# EAGLE design ESP8266 12E 1.5 (EAGLE 9.6.2)
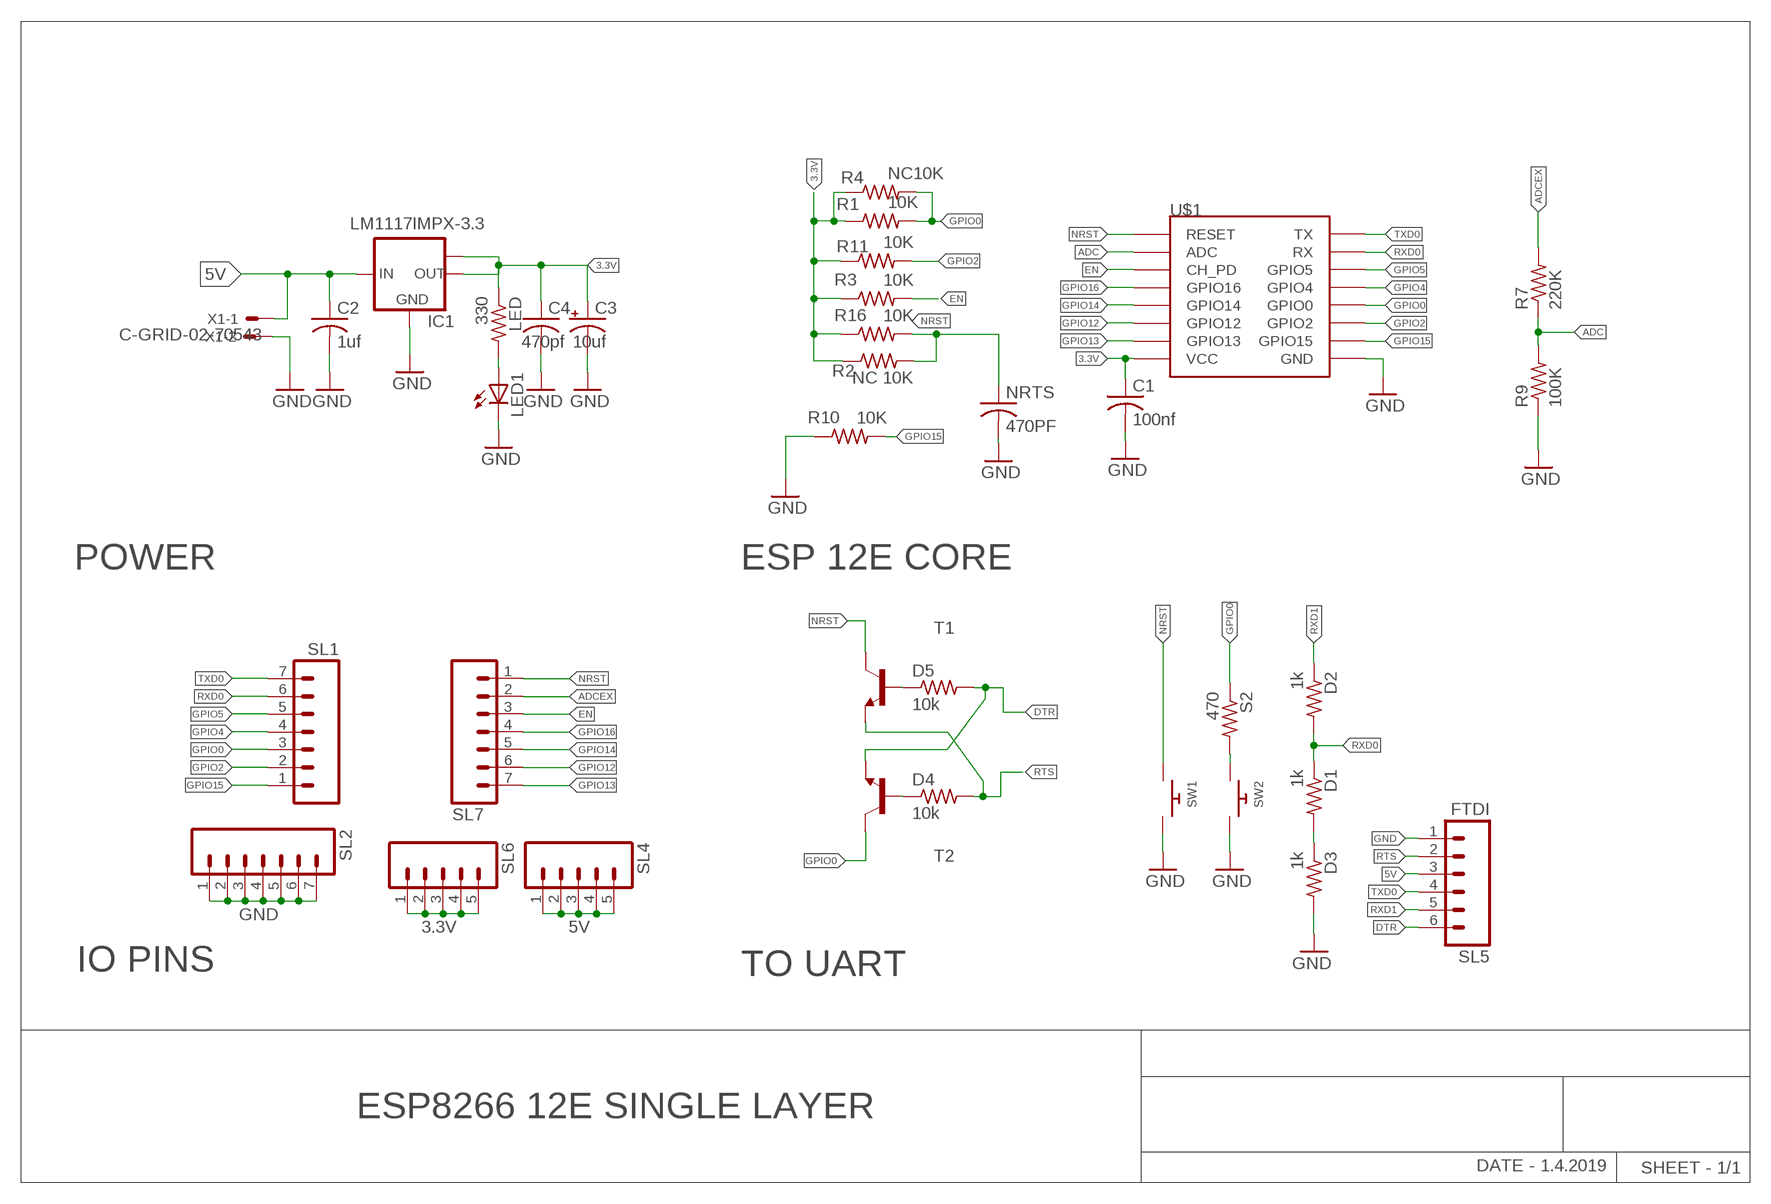
[diagram p0: schematic, sheet 1]

## Parts
C1  100nf  C-US050-025X075  [C050-025X075]
C2  1uf  C-US050-030X075  [C050-030X075]
C3  10uf  CPOL-USE2.5-5  [E2,5-5]
C4  470pf  C-US050-025X075  [C050-025X075]
D1  1k  R-US_0309/10  [0309/10]
D2  1k  R-US_0309/10  [0309/10]
D3  1k  R-US_0309/10  [0309/10]
D4  10k  R-US_0309/10  [0309/10]
D5  10k  R-US_0309/10  [0309/10]
IC1  LM1117IMPX-3.3  [SOT223]
LED  330  R-US_0309/10  [0309/10]
LED1  LED3MM  [LED3MM]
NRTS  470PF  C-US050-025X075  [C050-025X075]
R1  10K  R-US_0207/7  [0207/7]
R2  NC 10K  R-US_M1206  [M1206]
R3  10K  R-US_0207/7  [0207/7]
R4  NC10K  R-US_0207/7  [0207/7]
R7  220K  R-US_0309/10  [0309/10]
R9  100K  R-US_0309/10  [0309/10]
R10  10K  R-US_0207/7  [0207/7]
R11  10K  R-US_0207/7  [0207/7]
R16  10K  R-US_0207/7  [0207/7]
S2  470  R-US_0309/10  [0309/10]
SL1  M07  [07P]
SL2  M07  [07P]
SL4  M05  [05P]
SL5  FTDI  M06  [06P]
SL6  M05  [05P]
SL7  M07  [07P]
SW1  SWITCH_PUSHBUTTONEVQ  [0204/5]
SW2  SWITCH_PUSHBUTTONEVQ  [0204/5]
T1  2N2222  [TO92-EBC-OVAL]
T2  2N2222  [TO92-EBC-OVAL]
U$1  ESP8266  [ESP8266MIRROR]
X1  C-GRID-02-70543  [70543-02]

## Nets
3.3V: C1.1 C3.+ C4.1 IC1.2(OUT) IC1.TAB(OUT1) LED.1 R1.1 R2.1 R3.1 R4.1 R11.1 R16.1 SL6.1 SL6.2 SL6.3 SL6.4 SL6.5 U$1.VCC
5V: C2.1 IC1.3(IN) SL4.1 SL4.2 SL4.3 SL4.4 SL4.5 SL5.3 X1.1
ADC: R7.1 R9.2 U$1.ADC
ADCEX: R7.2 SL7.2
DTR: D5.2 SL5.6 T2.E
EN: R3.2 SL7.3 U$1.EN(CH_PD)
GND: C1.2 C2.2 C3.- C4.2 D3.2 IC1.1(GND) LED1.K(C) NRTS.2 R9.1 R10.1 SL2.1 SL2.2 SL2.3 SL2.4 SL2.5 SL2.6 SL2.7 SL5.1 SW1.2 SW2.2 U$1.GND X1.2
GPIO0: R1.2 R4.2 S2.1 SL1.3 T2.C U$1.0(GPIO0)
GPIO2: R11.2 SL1.2 U$1.2(GPIO2)
GPIO4: SL1.4 U$1.4(GPIO4)
GPIO5: SL1.5 U$1.5(GPIO5)
GPIO12: SL7.6 U$1.12(GPIO12)
GPIO13: SL7.7 U$1.13(GPIO13)
GPIO14: SL7.5 U$1.14(GPIO14)
GPIO15: R10.2 SL1.1 U$1.15(GPIO15)
GPIO16: SL7.4 U$1.16(GPIO16)
N$1: D5.1 T1.B
N$2: D4.1 T2.B
N$3: S2.2 SW2.1
N$4: LED1.A LED.2
N$5: D1.2 D3.1
NRST: NRTS.1 R2.2 R16.2 SL7.1 SW1.1 T1.C U$1.RST(RESET)
RTS: D4.2 SL5.2 T1.E
RXD0: D1.1 D2.2 SL1.6 U$1.RX
RXD1: D2.1 SL5.5
TXD0: SL1.7 SL5.4 U$1.TX

## Notes on the sheet
- POWER | ESP 12E CORE
- IO PINS | TO UART
- ESP8266 12E SINGLE LAYER
- DATE - 1.4.2019 | SHEET - 1/1

## Library data of the parts
C1 C4 NRTS = resistor:C-US: CAPACITOR, American symbol
C2 = adafruit:C-US: CAPACITOR, American symbol
C3 = adafruit:CPOL-US: POLARIZED CAPACITOR, American symbol
D1-D5 LED R1-R4 R7 R9-R11 R16 S2 = adafruit:R-US_: RESISTOR, American symbol
IC1 = lm1117:LM1117IMPX-*
LED1 = adafruit:LED: LED OSRAM: - CHIPLED LG R971, LG N971, LY N971, LG Q971, LY Q971, LO R971, LY R971 LH N974, LH R974 LS Q976, LO Q976, LY Q976 LO Q996 - Hyper CHIPLED LW Q18S LB Q993, LB Q99A, LB R99A - SideLED LS A670, LO A670, LY A670, LG A670, LP A670 LB A673, LV A673, LT A673, LW A673 LH A674 LY A675 LS A676, LA A676, LO A676, LY A676, LW A676 LS A679, LY A679, LG A679 - Hyper Micro SIDELED® LS Y876, LA Y876, LO Y876, LY Y876 LT Y87S - SmartLED LW L88C, LW L88S LB L89C, LB L89S, LG L890 LS L89K, LO L89K, LY L89K LS L896, LA L896, LO L896, LY L896 - TOPLED LS T670, LO T670, LY T670, LG T670, LP T670 LSG T670, LSP T670, LSY T670, LOP T670, LYG T670 LG T671, LOG T671, LSG T671 LB T673, LV T673, LT T673, LW T673 LH T674 LS T676, LA T676, LO T676, LY T676, LB T676, LH T676, LSB T676, LW T676 LB T67C, LV T67C, LT T67C, LS T67K, LO T67K, LY T67K, LW E67C LS E67B, LA E67B, LO E67B, LY E67B, LB E67C, LV E67C, LT E67C LW T67C LS T679, LY T679, LG T679 LS T770, LO T770, LY T770, LG T770, LP T770 LB T773, LV T773, LT T773, LW T773 LH T774 LS E675, LA E675, LY E675, LS T675 LS T776, LA T776, LO T776, LY T776, LB T776 LHGB T686 LT T68C, LB T68C - Hyper Mini TOPLED® LB M676 - Mini TOPLED Santana® LG M470 LS M47K, LO M47K, LY M47K Source: http://www.osram.convergy.de/
SL1 SL2 SL7 = con-amp-quick:M07: AMP QUICK CONNECTOR; OC_FARNELL: unknown; OC_NEWARK: unknown
SL4 SL6 = con-amp-quick:M05: AMP QUICK CONNECTOR; OC_FARNELL: unknown; OC_NEWARK: unknown
SL5 = con-amp-quick:M06: AMP QUICK CONNECTOR; OC_FARNELL: unknown; OC_NEWARK: unknown
SW1 SW2 = mylib:SWITCH_PUSHBUTTON: Buttons SOFTTOUCHSMD_SJ - Soft touch temporary push button (Super Junk Akihabara) Compatible with SKPMANE010 [Mouser: 688-SKPMAN] C&K_KSS = Digikey: KSS221GLFS
T1 T2 = adafruit:2N2222: NPN TRANSISTOR Big oval pads
U$1 = ESPCUSTOM:ESP8266
X1 = con-molex:C-GRID-02: CONNECTOR wire to board 2.54 mm (0.100") pitch header; MF: MOLEX; OC_FARNELL: unknown; OC_NEWARK: unknown

## Net classes
0 default: clearance 0.406 mm
1 VCC: width 0.762 mm, clearance 0.406 mm
2 GND: width 0.914 mm, clearance 0.406 mm

## Board
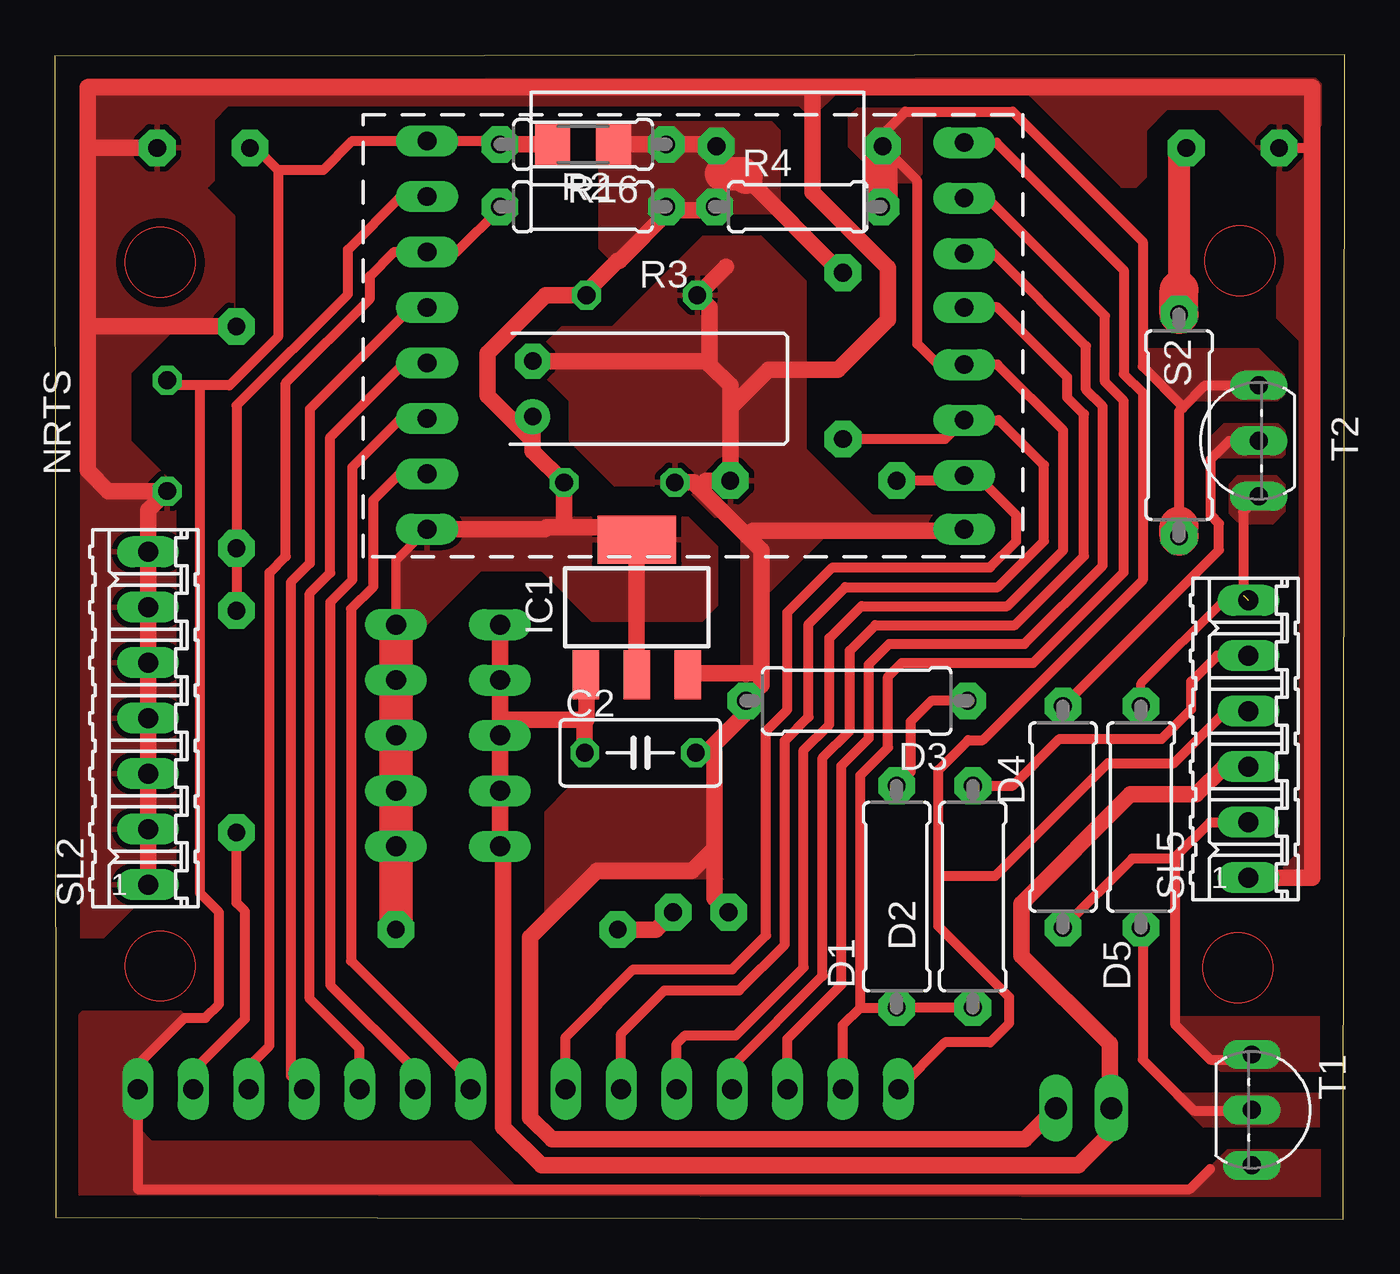
[diagram p1: board, top side]
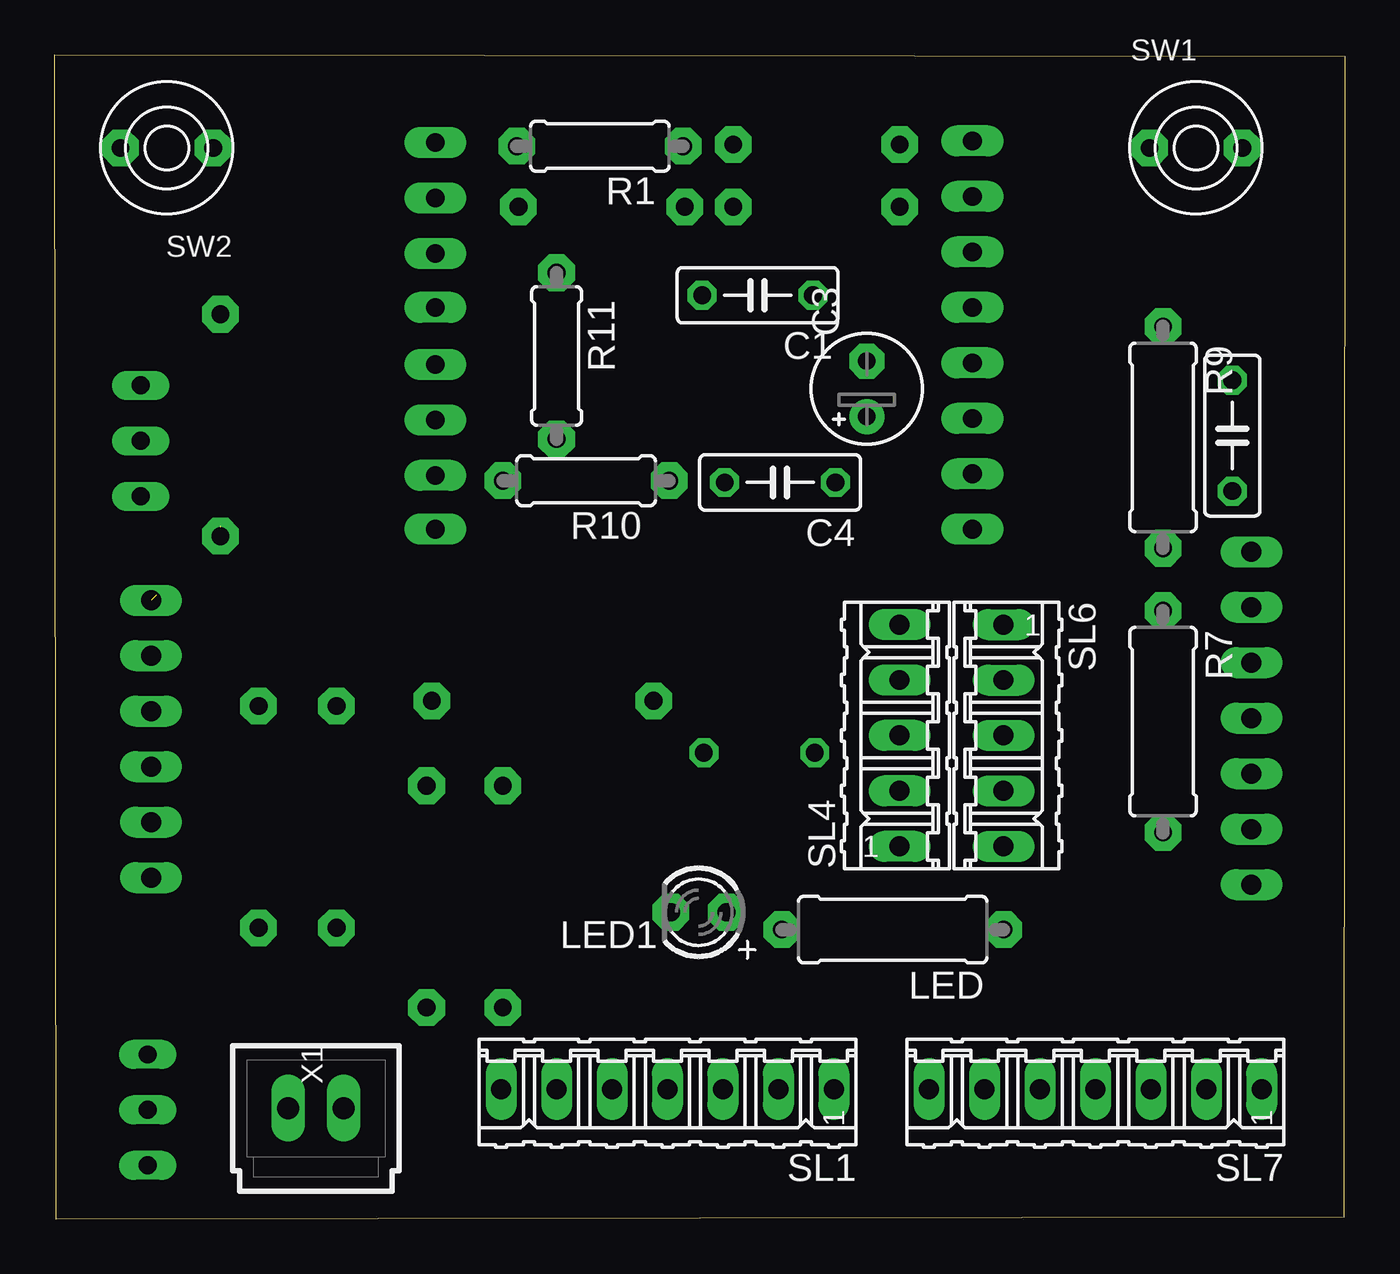
[diagram p2: board, bottom side, seen from below]

Size 59.11 x 53.33 mm. Coordinates in mm from the lower left corner, seen from the top.
Outline: 0.05,0.08 59.04,0 59.11,53.33 0,53.25 0.05,0.08
Copper layers (1*16): Top 0.035mm / dielectric 1.5mm / Bottom 0.035mm
Design rules "default": minimum track width 6mil, minimum drill 0.35mm, track to track 6mil, track to pad 6mil, pad to pad 6mil, via to via 6mil, smd to smd 6mil, copper to edge 40mil, drill to drill 6mil, minimum pad ring 10mil, minimum via ring 8mil, stop-mask expansion 4mil, vias tented up to drill 0mil, thermal gap 10mil

### Footprints (pad centres in the part's own frame; a part is rotated, then mirrored left to right if it is on the bottom)
C050-025X075 = drill 0.813 octagon: 1 -2.54,0; 2 2.54,0
C050-030X075 = drill 0.813 octagon: 1 -2.54,0; 2 2.54,0
E2,5-5 = drill 0.813 pad 1.6: + -1.27,0 | drill 0.813 pad 1.6 octagon: - 1.27,0
0309/10 = drill 0.813 pad 1.676 octagon: 1 -5.08,0; 2 5.08,0
SOT223 = smd 1.219 x 2.235: 1 2.332,-3.099; 2 0,-3.099; 3 -2.332,-3.099 | smd 3.6 x 2.2: TAB 0,3.099
LED3MM = drill 0.813 pad 1.676 octagon: A -1.27,0; K 1.27,0
0207/7 = drill 0.813 pad 1.676 octagon: 1 -3.81,0; 2 3.81,0
M1206 = smd 1.6 x 2: 1 -1.4,0; 2 1.4,0
07P = drill 0.914 long: 1 -7.62,0; 2 -5.08,0; 3 -2.54,0; 4 0,0; 5 2.54,0; 6 5.08,0; 7 7.62,0
05P = drill 0.914 long: 1 -5.08,0; 2 -2.54,0; 3 0,0; 4 2.54,0; 5 5.08,0
06P = drill 0.914 long: 1 -6.35,0; 2 -3.81,0; 3 -1.27,0; 4 1.27,0; 5 3.81,0; 6 6.35,0
0204/5 = drill 0.813 pad 1.676 octagon: 1 -2.125,0; 2 2.125,0
TO92-EBC-OVAL = drill 0.813 long: B 0,-1.27; C 2.54,-1.27; E -2.54,-1.27
ESP8266MIRROR = drill 0.85 pad 1.422 long: 0 12.224,-4.842; 2 12.224,-7.382; 4 12.224,-2.223; 5 12.224,0.238; 12 -12.383,-7.303; 13 -12.383,-9.842; 14 -12.383,-4.763; 15 12.224,-9.922; 16 -12.383,-2.223; ADC -12.383,2.857; EN -12.383,0.318; GND 12.224,-12.383; RST -12.383,5.397; RX 12.224,2.778; TX 12.224,5.318; VCC -12.383,-12.383
70543-02 = drill 1.016 long: 1 -1.27,0; 2 1.27,0

### Placement (x,y rotation side)
C1  26.91,42.31 180 bottom
C2  26.83,21.35 0 top
C3  21.91,38.02 90 bottom
C4  25.88,33.73 180 bottom
D1  38.58,14.76 90 top
D2  42.07,14.76 270 top
D3  36.75,23.73 180 top
D4  46.2,18.41 270 top
D5  49.77,18.41 90 top
IC1  26.67,28.02 0 top
LED  20.72,13.26 180 bottom
LED1  29.61,14.05 180 bottom
NRTS  5.16,35.88 270 bottom
R1  34.13,49.13 180 bottom
R2  24.21,49.21 180 top
R3  24.21,46.36 180 top
R4  34.05,46.36 0 top
R7  8.33,22.78 270 bottom
R9  8.33,35.8 270 bottom
R10  34.77,33.81 180 bottom
R11  36.12,39.53 270 bottom
R16  24.21,49.21 180 top
S2  51.51,36.35 90 top
SL1  31.04,5.95 180 bottom
SL2  4.29,22.94 90 top
SL4  20.4,22.15 90 bottom
SL5  54.69,21.99 90 top
SL6  15.64,22.15 270 bottom
SL7  11.43,5.95 180 bottom
SW1  6.83,49.05 0 bottom
SW2  53.98,49.05 180 bottom
T1  56.12,5 270 top
T2  53.9,35.64 90 top
U$1  29.45,43.97 0 top
X1  47.15,5.08 0 bottom

### Tracks (layer width: path | path; a pad name or v marks a point on that pad's centre or on a via)
3.3V
  Top 0.406: SL6.1 15.64,30.16 U$1.VCC
  Top 0.457: R3.1 28.02,46.91
  Top 0.762: 28.18,46.2 25.88,43.89 25.8,43.89 24.37,42.47 C1.1 22.5,42.31 19.84,39.65 19.84,37.7 21.91,35.64 | R3.1 28.18,46.2 | 28.18,46.2 30.56,46.2 30.56,47.86 30.56,48.97 30.32,49.21 R16.1 R2.1 | IC1.2 IC1.TAB 26.12,31.67 23.34,31.67 | 23.34,31.67 22.54,31.67 22.46,31.59 U$1.VCC | 23.34,31.67 C4.1 21.91,35.16 21.91,35.64 | 21.91,35.64 C3.+ | R11.1 36.04,43.34 31.67,47.7
  Top 1.524: 31.67,47.7 31.51,47.86 30.56,47.86 | LED.1 SL6.5 SL6.4 SL6.3 SL6.2 SL6.1
  pour Top: 15.72,29.69 22.3,29.69 24.61,27.38 29.69,27.38 30.4,28.1 30.4,30.8 29.05,32.15 17.46,32.15 16.67,31.35 15.8,30.16 15.72,30.08
  pour Top (no thermals): 24.92,49.21 24.92,44.45 25.72,43.66 28.1,46.04 30.08,46.04 33.18,46.04 33.26,45.96 33.26,49.85 32.86,50.24 26.04,50.24 25.32,49.53
  pour Top (no thermals): 15.64,27.38 15.64,29.84 15.8,30 18.57,30 19.69,30 19.76,29.92 16.51,26.67 16.11,26.67
5V
  Top 0.457: SL4.2 20.4,19.84 | 23.42,22.86 24.29,22.86 24.37,22.86 | SL5.3 53.58,20.72
  Top 0.762: SL4.1 SL4.2 SL4.3 20.4,22.94 | 20.4,22.94 SL4.4 SL4.5 | C2.1 24.29,22.86 | 20.16,16.83 SL4.1 | 20.4,22.94 20.48,22.86 23.42,22.86 24.37,22.86 24.37,24.89 IC1.3 | SL4.1 20.56,16.91 20.56,4.21 22.3,2.46 46.91,2.46 48.42,3.97 X1.1 48.34,5.16 48.34,8.02 44.29,12.06 44.29,14.45 49.29,19.45 52.31,19.45 53.58,20.72
ADC
  Top 0.457: R7.1 R9.2 8.33,37.26 13.44,42.36 13.44,44.39 15.88,46.83 U$1.ADC
ADCEX
  Top 0.457: SL7.2 6.35,6.8 8.72,9.17 8.72,14.09 8.33,14.48 R7.2
DTR  (1 unrouted)
  Top 0.406: 53.58,28.34 49.77,24.53 D5.2
  Top 0.457: T2.E 54.45,32.38 54.45,28.57 | SL5.6 53.58,28.34
  pour Top (no thermals): 54.21,31.91 53.82,32.31 53.82,33.66 54.21,34.05 55.96,34.05 56.36,33.66 56.36,32.38 55.8,31.83 54.53,31.83
EN
  Top 0.457: R3.2 20.4,46.28 18.42,44.29 U$1.EN 15.56,44.29 14.45,43.18 14.45,42.15 10.6,38.3 10.6,30.35 9.85,29.61 9.85,7.94 8.89,6.98 SL7.3
GND
  Top 0.457: SW2.2 57.47,49.05 57.63,48.89
  Top 0.762: 1.51,41.12 1.51,34.29 2.46,33.34 NRTS.2 4.29,32.46 SL2.7 SL2.6 SL2.5 SL2.4 SL2.3 SL2.2 SL2.1 | 1.51,41.12 1.51,49.05 | 1.51,49.05 1.51,51.83 34.73,51.83 | 31.75,31.27 29.53,33.5 | 31.75,31.27 32.39,30.64 32.39,25 | 30.24,16.99 30.24,21.35 C2.2 29.85,21.35 31.67,23.18 D3.2 32.39,24.45 32.39,25 | 30.24,16.99 30.24,14.68 LED1.K | 30.24,16.99 29.21,15.95 24.84,15.95 21.79,12.9 21.79,4.64 22.78,3.65 44.45,3.65 X1.2 45.8,5.16 | 30,39.13 30,41.75 C1.2 30.76,43.61 | IC1.1 29.09,25 32.39,25 | C3.- 29.85,39.29 30,39.13 | 30,39.13 30.96,38.18 30.96,37.15 | U$1.GND 41.59,31.51 31.99,31.51 31.75,31.27 | C4.2 29.29,33.73 29.53,33.5 | 29.53,33.5 29.85,33.81 R10.1 30.96,37.15 | SW1.2 1.51,49.05 | R9.1 1.75,40.88 1.51,41.12 | 34.73,51.83 57.63,51.83 57.63,48.89 57.63,15.64 SL5.1 | 34.73,51.83 34.73,47.03 38.18,43.58 38.18,41.2 35.88,38.89 32.7,38.89 30.96,37.15
  pour Top: 4.29,14.92 2.22,12.86 1.19,12.86 1.19,51.91 1.59,52.31 4.05,52.31 4.76,51.59 4.76,49.45 8.26,45.96 8.26,40.88 8.33,40.8 5.56,40.8 3.49,38.73 3.49,35.64 5.56,33.58 5.56,16.11 4.52,15.08
  pour Top: 4.05,52.31 57.71,52.31 58.02,51.99 58.02,50.09 56.83,48.9 55.24,48.9 53.34,50.8 50.96,50.8 50.01,49.85 50.01,47.7 49.53,47.23 48.9,47.23 44.61,51.51 35.8,51.51 34.85,50.56 34.53,50.56 34.13,50.96 7.94,50.96 7.3,50.32 7.3,47.55 6.03,46.28 5.79,46.28 2.3,49.77 2.3,50.48 2.94,51.12
  pour Top: 21.79,39.25 23.57,37.47 23.57,35.64 25.64,33.58 31.04,33.58 31.12,33.5 31.12,33.26 30.08,33.26 29.92,33.42 29.92,32.94 31.43,31.43 31.43,25.08 31.59,24.92 31.59,24.21 32.07,23.73 32.07,26.19 32.54,26.67 32.54,30.72 32.31,30.96 32.38,31.04 32.62,30.8 32.62,30.72 32.7,30.64 32.7,28.65 35.56,31.51 41.83,31.51 41.83,31.99 41.59,32.23 37.46,32.23 31.04,38.66 31.04,43.5 30.72,43.81 28.81,41.91 28.81,39.69 28.65,39.53 23.02,39.53
  pour Top: 21.67,39.29 23.26,40.88 28.97,40.88 29.21,40.64 29.21,39.13 28.26,38.18 26.51,38.18 25.72,38.18 25.4,38.5
  pour Top: 22.46,14.05 22.46,18.65 23.57,19.76 30.32,19.76 30.32,15.88 30.64,15.56 24.45,15.56 23.42,14.53
  pour Top: 55.96,48.34 55.96,41.27 56.99,40.24 56.99,16.83 55.96,15.8 54.13,15.8 54.21,15.72 54.21,15.4 54.29,15.48 57.63,15.48 57.63,50.64 57.15,51.12 55.24,51.12
  pour Top: 34.45,34.69 34.45,42.94 32.38,45.01 29.69,45.01 24.92,40.24 24.92,37.47 30.24,32.15 36.75,32.15 34.37,34.53
GPIO0  (1 unrouted)
  Top 0.457: 28.5,6.19 SL1.3 28.5,8.02 28.89,8.41 31.21,8.41 34.32,11.52 34.32,21.47 35.49,22.64 35.49,26.6 36.97,28.07 43.65,28.07 46.21,30.64 46.21,36.12 43.2,39.13 U$1.0 40.48,39.13 39.53,40.08 39.53,47.55 R1.2 37.94,49.69 38.97,50.72 43.89,50.72 49.85,44.77 49.85,39.05 51.71,37.19 | 51.51,31.67 51.51,36.99 51.71,37.19 | T2.C 52.71,38.18 51.71,37.19
  Top 1.524: R4.2 37.86,49.05 R1.2
  Top 1.778: S2.1 51.51,31.75
  pour Top (no thermals): 52.31,37.47 56.04,37.47 56.36,37.78 56.36,38.66 55.17,39.85 49.93,39.85 49.93,39.13 51.91,37.23 51.99,37.31
  pour Top (no thermals): 39.77,50.88 36.75,50.88 36.35,50.48 36.35,49.13 38.02,47.47 39.37,47.47 39.77,47.86
GPIO2
  Top 0.457: SL1.2 25.96,8.49 27.94,10.48 31.36,10.48 33.46,12.57 33.46,21.91 34.54,22.99 34.54,27.25 36.23,28.94 43.21,28.94 45.32,31.05 45.32,34.53 43.26,36.59 U$1.2 40.8,35.72 R11.2
GPIO4
  Top 0.457: U$1.4 43.2,41.75 46.39,38.56 46.39,37.62 47.16,36.86 47.16,30.36 44,27.2 37.6,27.2 36.43,26.03 36.43,22.37 35.18,21.11 35.18,11.13 31.04,6.98 SL1.4 31.04,6.19
GPIO5
  Top 0.457: U$1.5 43.02,44.21 47.26,39.98 47.26,37.98 48.02,37.21 48.02,29.92 44.44,26.34 38.24,26.34 37.31,25.4 37.31,22.02 36.05,20.76 36.05,10.72 33.58,8.25 SL1.5 33.58,6.19
GPIO12
  Top 0.457: U$1.12 15.88,36.67 13.65,34.45 13.65,29.28 12.63,28.26 12.63,10.72 16.51,6.84 SL7.6
GPIO13
  Top 0.457: U$1.13 15.8,34.13 14.61,32.94 14.61,28.97 13.58,27.94 13.58,11.82 19.05,6.35 SL7.7
GPIO14
  Top 0.457: U$1.14 16.04,39.21 12.63,35.8 12.63,29.6 11.69,28.65 11.69,10.08 13.97,7.8 SL7.5
GPIO15
  Top 0.457: 40.64,34.05 U$1.15 | SL1.1 23.42,8.33 26.51,11.43 31.04,11.43 32.59,12.99 32.59,22.35 33.58,23.33 33.58,27.78 35.64,29.85 42.86,29.85 44.05,31.04 44.05,32.23 42.23,34.05 U$1.15 | U$1.15 41.43,33.81 R10.2
GPIO16
  Top 0.457: U$1.16 16.35,41.75 12.46,37.86 11.69,37.09 11.69,30.02 10.82,29.16 10.82,6.56 SL7.4
N$1
  Top 0.457: D5.1 49.85,13.26 49.85,7.3 52.19,4.96 54.81,4.96 T1.B
  pour Top (isolate 0.254, no thermals): 51.4,5.79 57.94,5.79 57.94,4.21 52.63,4.21 51.28,5.56
N$2
  Top 0.457: D4.1 53.34,30.64 53.34,31.85 52.97,32.23 52.97,34.79 53.82,35.64 T2.B
  pour Top (no thermals): 53.02,35.16 53.02,35.88 53.58,36.43 56.04,36.43 56.36,36.12 56.36,35 56.2,34.85 53.18,34.85
N$3
  Top 0.457: 51.51,42.54 51.51,43.37
  Top 1.016: 51.51,42.54 51.51,48.72 SW2.1
  Top 1.778: S2.2 51.51,42.54
N$4
  Top 0.762: LED1.A 27.54,13.26 LED.2
N$5
  Top 0.457: D1.2 39.21,20.48 39.21,22.78 40.16,23.73 D3.1
NRST
  Top 0.457: NRTS.1 5.16,38.18 6.67,38.18 | 52.94,2.3 52.01,1.37 3.81,1.37 SL7.1 3.81,7.06 5.95,9.21 6.91,9.21 7.54,9.84 7.54,14.05 6.67,14.92 6.67,38.18 | 12.32,48.03 12.3,48.03 | 12.3,48.03 10.24,48.03 | 20.24,49.37 U$1.RST 13.64,49.37 12.3,48.03 | 10.24,48.03 10.24,40.4 8.02,38.18 6.67,38.18 | SW1.1 9.22,49.05 10.24,48.03
  Top 0.762: R2.2 R16.2 20.24,49.37
  pour Top (no thermals): 6.03,9.29 5.79,9.53 1.27,9.53 1.11,9.37 1.11,0.32 58.02,0.32 58.02,3.18 53.74,3.18 52.07,1.51 21.11,1.51 19.05,3.57 4.45,3.57 3.89,4.13 3.89,6.98 5.95,9.05
RTS
  Top 0.457: 51.36,16.51 51.36,8.89 52.94,7.3 54.61,7.3 T1.E | 51.36,16.51 51.36,16.59 52.94,18.18 SL5.2 | D4.2 49.37,16.51 51.36,16.51
  pour Top (no thermals): 53.42,6.75 51.59,8.57 51.59,9.29 57.94,9.29 57.94,6.75
RXD0
  Top 0.457: 36.12,6.19 SL1.6 36.12,8.89 36.91,9.68 | 36.91,9.68 36.91,20.32 38.18,21.59 38.18,24.84 38.81,25.47 44.84,25.47 48.98,29.62 48.98,37.47 48.12,38.34 48.12,41.37 42.73,46.75 U$1.RX | D2.2 D1.1 36.91,9.68
RXD1
  Top 0.457: D2.1 43.89,19.84 46.04,21.99 50.72,21.99 52.07,23.34 52.07,24.61 53.26,25.8 SL5.5
TXD0
  Top 0.457: U$1.TX 43.15,49.29 48.98,43.46 48.98,38.69 49.85,37.83 49.85,29.26 42.52,21.93 41.86,21.93 40.48,20.56 40.48,15.72 | SL1.7 40.8,8.1 42.86,8.1 43.74,8.97 43.74,10.16 40.48,13.41 40.48,15.72 | 40.48,15.72 43.1,15.72 48.26,20.88 51.28,20.88 53.66,23.26 SL5.4
(copper drawn outside any net)
  shapes: Top circle x4

### Text on the board
Document: GPIO0 PULL UP / RESISTORS